# Altium schematic sheet RS_transceiver.SchDoc
size A4; SheetNumber: 4; SheetTotal: 6
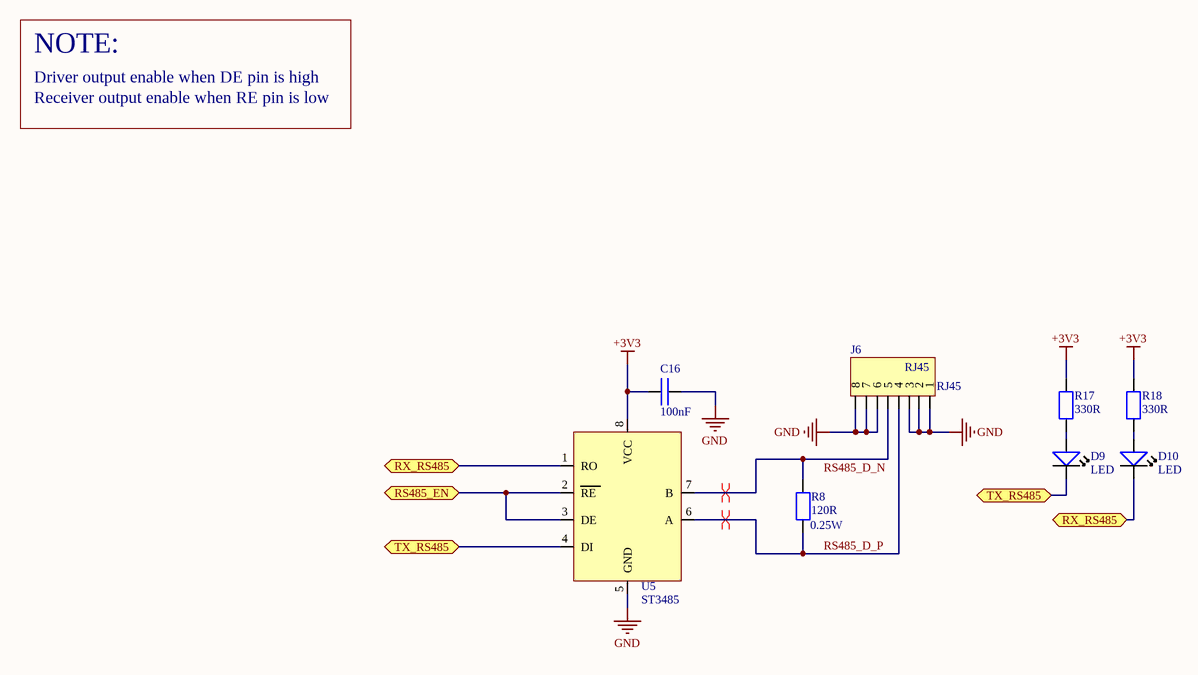
[diagram p0: RS_transceiver.SchDoc]

## Parts
C16  100nF  [C0603]
D9  LED  [LED0805]
D10  LED  [LED0805]
J6  RJ45  [RJ45]
R8  120R  [R0805]
R17  330R  [R0805]
R18  330R  [R0805]
U5  ST3485  [SO8]

## Ports
RS485_EN (bidir), RX_RS485 (bidir), TX_RS485 (bidir)

## Nets
+3V3: C16.2 R17.2 R18.2 U5.8(VCC)
GND: C16.1 J6.1 J6.2 J6.3 J6.6 J6.7 J6.8 U5.5(GND)
RS485_D_N: J6.5 R8.2 U5.7(B)
RS485_D_P: J6.4 R8.1 U5.6(A)
RS485_EN: U5.2(RE) U5.3(DE) ; port RS485_EN
RX_RS485: D10.K U5.1(RO) ; port RX_RS485
TX_RS485: D9.K U5.4(DI) ; port TX_RS485
NetD9_A: D9.A R17.1
NetD10_A: D10.A R18.1

## Layout directives
differential pair: RS485_D_N, RS485_D_P

## Notes on the sheet
- NOTE:
- Driver output enable when DE pin is high
- Receiver output enable when RE pin is low
- (near R8) 0.25W

## Library data of the parts
C16 = Cap_SMD
R8 R17 R18 = Res